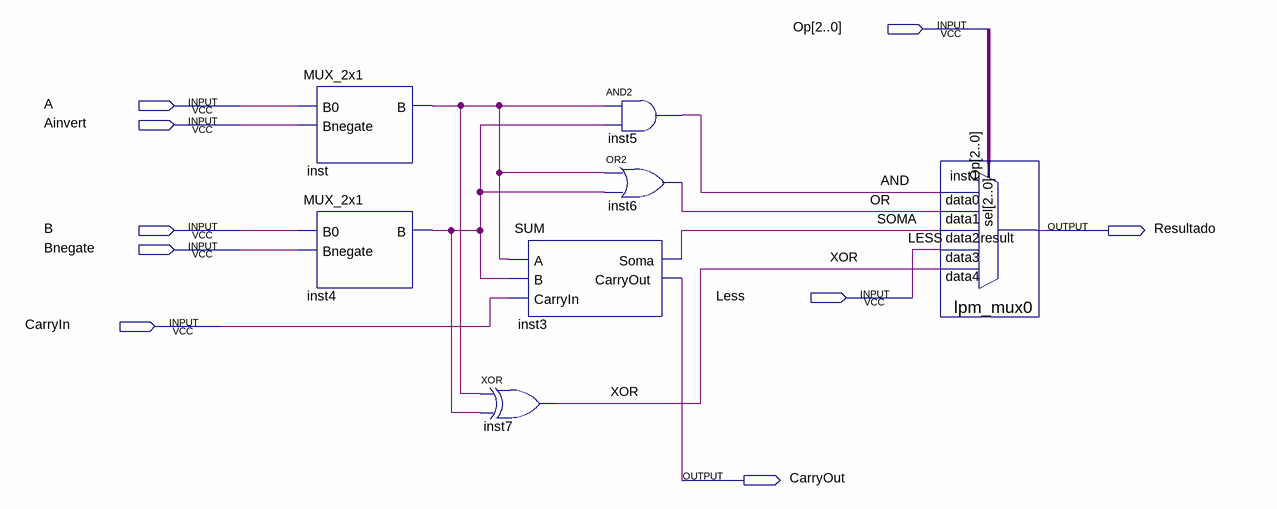
[diagram p0: schematic sheet]
// Quartus schematic Operador.bdf as structural Verilog: 7 symbols, 9 pins
module Operador (
  input  [2:0] Op,
  input  A,
  input  Ainvert,
  input  B,
  input  Bnegate,
  input  Less,
  input  CarryIn,
  output Resultado,
  output CarryOut
);

  wire AND, inst4_b, inst_b, OR, SOMA, XOR;

  MUX_2x1 inst (.B0(A), .Bnegate(Ainvert), .B(inst_b));
  MUX_2x1 inst4 (.B0(B), .Bnegate(Bnegate), .B(inst4_b));
  xor inst7 (XOR, inst_b, inst4_b);
  SUM inst3 (.A(inst_b), .B(inst4_b), .CarryIn(CarryIn), .Soma(SOMA), .CarryOut(CarryOut));
  and inst5 (AND, inst_b, inst4_b);
  or inst6 (OR, inst_b, inst4_b);
  lpm_mux0 inst1 (.data4(XOR), .data3(Less), .data2(SOMA), .data1(OR), .data0(AND), .sel(Op), .result(Resultado));
endmodule
